# Altium project eBox.PrjPcb
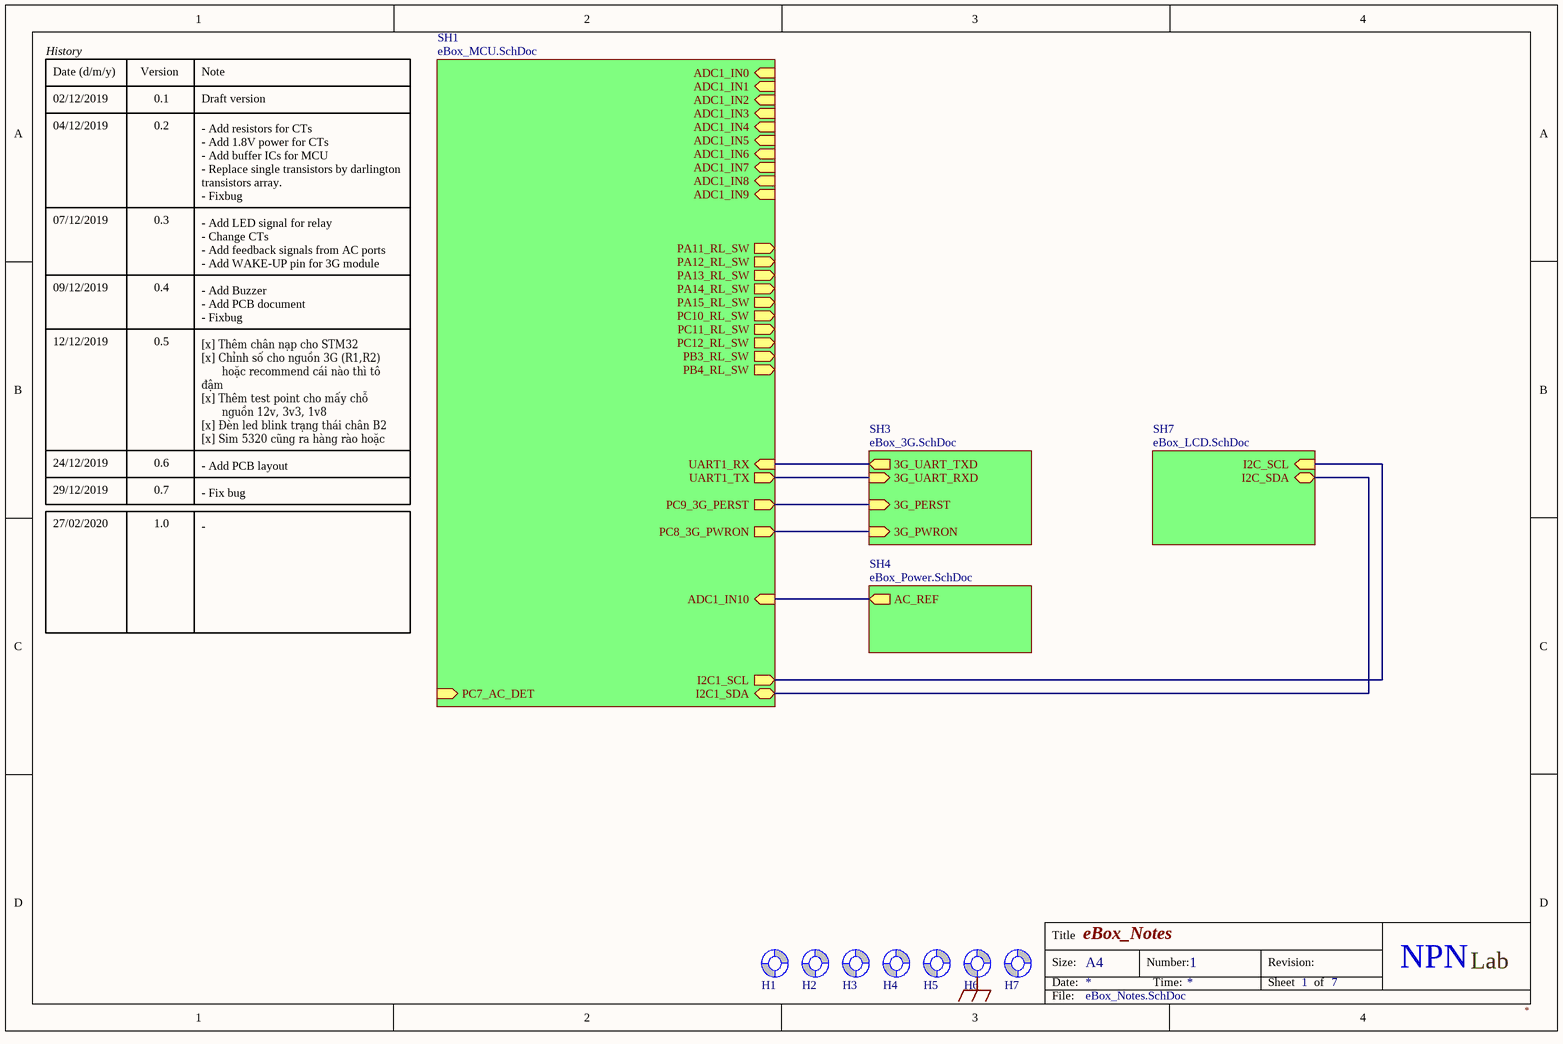
[diagram p0: eBox_Notes.SchDoc]
prjVersion: 2.0
6 sheets, 184 parts. Net scope: hierarchical (ports join the sheet entries above them; power ports are global).
Board file: eBox.PcbDoc
Sheets:
  eBox_Notes.SchDoc
    SH1 = eBox_MCU.SchDoc
    SH3 = eBox_3G.SchDoc
    SH4 = eBox_Power.SchDoc
    SH7 = eBox_LCD.SchDoc
  highcurrentsensing.SchDoc

## Sheet eBox_Notes.SchDoc: eBox_Notes
size A4; DocumentNumber: 1; Revision: 2.0; SheetNumber: 1; SheetTotal: 7

### Parts
H1  Screw Hole  [SCREW/3.2/7.0/M]  (value not drawn)  (no BOM)
H2  Screw Hole  [SCREW/3.2/7.0/M]  (value not drawn)  (no BOM)
H3  Screw Hole  [SCREW/3.2/7.0/M]  (value not drawn)  (no BOM)
H4  Screw Hole  [SCREW/3.2/7.0/M]  (value not drawn)  (no BOM)
H5  Screw Hole  [SCREW/3.2/7.0/M]  (value not drawn)  (no BOM)
H6  Screw Hole  [SCREW/3.2/7.0/M]  (value not drawn)  (no BOM)
H7  Screw Hole  [SCREW/3.2/7.0/M]  (value not drawn)  (no BOM)

### Sub-sheets
SH1 = eBox_MCU.SchDoc: PC8_3G_PWRON (out), PC9_3G_PERST (out), UART1_RX (in), UART1_TX (out), ADC1_IN0 (in), ADC1_IN1 (in), ADC1_IN2 (in), ADC1_IN3 (in), ADC1_IN4 (in), ADC1_IN5 (in), ADC1_IN6 (in), ADC1_IN9 (in), ADC1_IN7 (in), PA12_RL_SW (out), ADC1_IN8 (in), PA11_RL_SW (out), PA13_RL_SW (out), PA14_RL_SW (out), PA15_RL_SW (out), PC10_RL_SW (out), PC11_RL_SW (out), PB3_RL_SW (out), PB4_RL_SW (out), PC12_RL_SW (out), I2C1_SCL (out), I2C1_SDA (bidir), PC7_AC_DET (in), ADC1_IN10 (in)
SH3 = eBox_3G.SchDoc: 3G_UART_RXD (in), 3G_PERST (in), 3G_PWRON (in), 3G_UART_TXD (out)
SH4 = eBox_Power.SchDoc: AC_REF (out)
SH7 = eBox_LCD.SchDoc: I2C_SCL (in), I2C_SDA (bidir)

### Nets
GNDEARTH: H6.1(Screw)
I2C1_SCL: sheet SH1/I2C1_SCL, sheet SH7/I2C_SCL
I2C1_SDA: sheet SH1/I2C1_SDA, sheet SH7/I2C_SDA
PERST: sheet SH1/PC9_3G_PERST, sheet SH3/3G_PERST
PWRON: sheet SH1/PC8_3G_PWRON, sheet SH3/3G_PWRON
UART_RXD: sheet SH1/UART1_RX, sheet SH3/3G_UART_TXD
UART_TXD: sheet SH1/UART1_TX, sheet SH3/3G_UART_RXD
NetR103_1: sheet SH1/ADC1_IN10, sheet SH4/AC_REF

Not connected (* = marked no-connect by the designer): H1 1(Screw); H2 1(Screw); H3 1(Screw); H4 1(Screw); H5 1(Screw); H7 1(Screw)

### Notes on the sheet
- History
- Date (d/m/y)
- 02/12/2019
- Version
- 0.1
- Note
- Draft version
- 04/12/2019
- 0.2
- 07/12/2019
- 0.3
- - Add resistors for CTs
  - Add 1.8V power for CTs
  - Add buffer ICs for MCU
  - Replace single transistors by darlington  transistors array.
  - Fixbug
- 09/12/2019
- 0.4
- - Add LED signal for relay
  - Change CTs
  - Add feedback signals from AC ports
  - Add WAKE-UP pin for 3G module
- 12/12/2019
- 0.5
- - Add Buzzer
  - Add PCB document
  - Fixbug
- [x] Thêm chân nạp cho STM32
  [x] Chỉnh số cho nguồn 3G (R1,R2)
  hoặc recommend cái nào thì tô đậm
  [x] Thêm test point cho mấy chỗ
  nguồn 12v, 3v3, 1v8
  [x] Đèn led blink trạng thái chân B2
  [x] Sim 5320 cũng ra hàng rào hoặc
  test point uart để test
- 24/12/2019
- 29/12/2019
- 0.6
- 0.7
- - Add PCB layout
- - Fix bug
- 27/02/2020
- 1.0
- -
- Title
- Size:
- Date:
- A4
- Number:
- Time:
- Revision:
- Sheet
- of
- NPN
- Lab
- File:

### Library data of the parts
H1-H7 = Screw Hole: TYPE: NO-BOM; UNIT PRICE: 0

## Sheet eBox_MCU.SchDoc: eBox_MCU
size A4; DocumentNumber: 3; Revision: 2.0; SheetNumber: 3; SheetTotal: 7
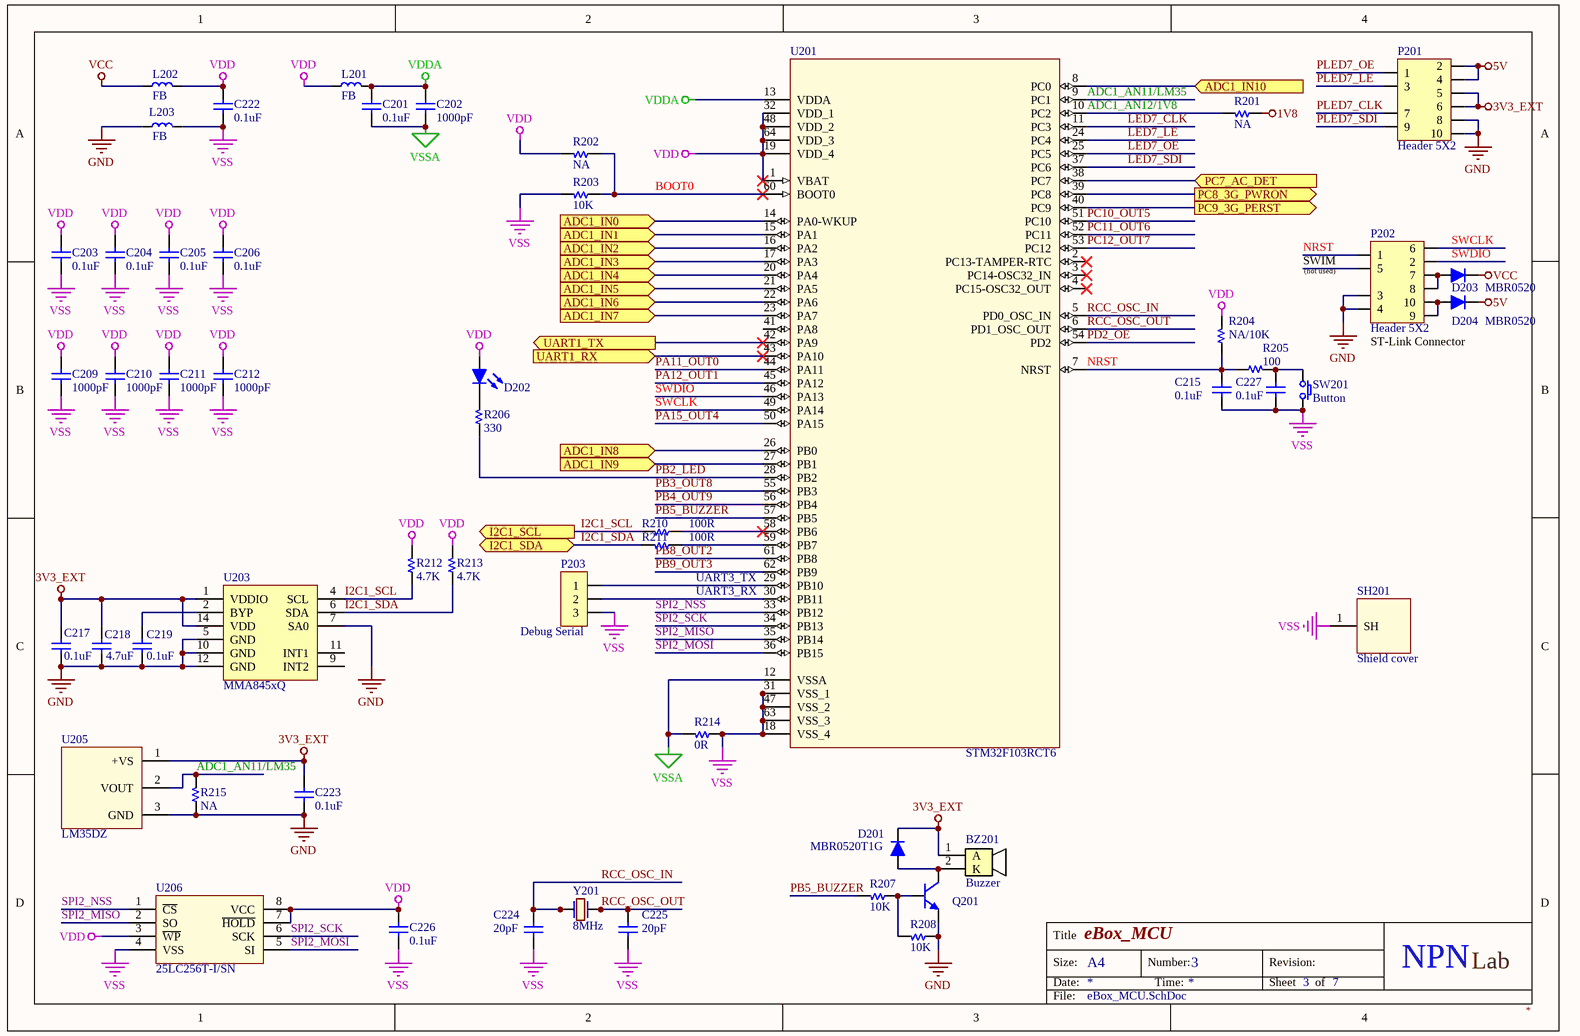
[diagram p1: eBox_MCU.SchDoc]

### Parts
BZ201  Buzzer  [BUZZER]
C201  0.1uF  [C 0603]
C202  1000pF  [C 0603]
C203  0.1uF  [C 0603]
C204  0.1uF  [C 0603]
C205  0.1uF  [C 0603]
C206  0.1uF  [C 0603]
C209  1000pF  [C 0603]
C210  1000pF  [C 0603]
C211  1000pF  [C 0603]
C212  1000pF  [C 0603]
C215  0.1uF  [C 0603]
C217  0.1uF  [C 0603]
C218  4.7uF  [C 0603]
C219  0.1uF  [C 0603]
C222  0.1uF  [C 0805]
C223  0.1uF  [C 0603]
C224  20pF  [C 0603]
C225  20pF  [C 0603]
C226  0.1uF  [C 0603]
C227  0.1uF  [C 0603]
D201  MBR0520T1G  [Diode SOD-123]
D202  5V Led  [LED 3MM - blue]  (value not drawn)
D203  MBR0520  [SOD123]
D204  MBR0520  [SOD123]
L201  FB  [L 0805 (2012)]
L202  FB  [L 0805 (2012)]
L203  FB  [L 0805 (2012)]
P201  Header 5X2  [HDR/Header/10/DL/BOX]
P202  Header 5X2  [HDR/Header/10/DL/BOX]
P203  Debug Serial  [HDR/Header/3]
Q201  LMBT3904LT1G  [SOT-23]  (value not drawn)
R201  NA  [R 0603]
R202  NA  [R 0603]
R203  10K  [R 0603]
R204  NA/10K  [R 0603]
R205  100  [R 0603]
R206  330  [R 0603]
R207  10K  [R 0603]
R208  10K  [R 0603]
R210  100R  [R 0603]
R211  100R  [R 0603]
R212  4.7K  [R 0603]
R213  4.7K  [R 0603]
R214  0R  [R 0603]
R215  NA  [R 0603]
SH201  Shield cover  [SHIELD COVER 50x35]  (no BOM)
SW201  Button  [SW/2/DIP]
U201  STM32F103RCT6  [STM-LQFP64]
U203  MMA845xQ  [MMA845xQ]
U205  LM35DZ  [TO-92/W100]
U206  25LC256T-I/SN  [SOIC-8-I/SN]
Y201  8MHz  [Crystal HC49US SMD]
Y202  NA  [Crystal HC49S DIP]  (value not drawn)  (no BOM)

### Ports
ADC1_IN0 (in), ADC1_IN1 (in), ADC1_IN2 (in), ADC1_IN3 (in), ADC1_IN4 (in), ADC1_IN5 (in), ADC1_IN6 (in), ADC1_IN7 (in), ADC1_IN8 (in), ADC1_IN9 (in), ADC1_IN10 (in), I2C1_SCL (out), I2C1_SDA (bidir), PC7_AC_DET (in), PC8_3G_PWRON (out), PC9_3G_PERST (out), UART1_RX (in), UART1_TX (out)

### Nets
1V8: R201.1
3V3_EXT: BZ201.1(A) C217.1 C218.1 C223.1 D201.2(K) P201.5 P201.6 U203.1(VDDIO) U203.14(VDD) U205.1(+VS)
5V: D204.2(K) P201.2 P201.4
GND: C217.2 C218.2 C219.2 C223.2 L203.1 P201.8 P201.10 P202.3 P202.4 Q201.2(E) R208.1 R215.1 U203.5(GND) U203.7(SA0) U203.10(GND) U203.12(GND) U205.3(GND)
VCC: D203.2(K) L202.1
VDD: C203.1 C204.1 C205.1 C206.1 C209.1 C210.1 C211.1 C212.1 C222.1 C226.1 D202.1(A) L201.1 L202.2 R202.2 R204.2 R212.2 R213.2 U201.1(VBAT) U201.19(VDD_4) U201.32(VDD_1) U201.48(VDD_2) U201.64(VDD_3) U206.3(~{WP}) U206.7(~{HOLD}) U206.8(VCC)
VDDA: C201.1 C202.1 L201.2 U201.13(VDDA)
VSS: C203.2 C204.2 C205.2 C206.2 C209.2 C210.2 C211.2 C212.2 C215.2 C222.2 C224.2 C225.2 C226.2 C227.2 L203.2 P203.3 R203.2 R214.1 SH201.1(SH) SW201.2 U201.18(VSS_4) U201.31(VSS_1) U201.47(VSS_2) U201.63(VSS_3) U206.4(VSS)
VSSA: C201.2 C202.2 R214.2 U201.12(VSSA)
ADC1_AN11/LM35: R215.2 U201.9(PC1) U205.2(VOUT)
ADC1_AN12/1V8: R201.2 U201.10(PC2)
BOOT0: R202.1 R203.1 U201.60(BOOT0)
I2C1_SCL: R210.2 R212.1 U203.4(SCL) ; port I2C1_SCL
I2C1_SDA: R211.2 R213.1 U203.6(SDA) ; port I2C1_SDA
LED7_CLK: U201.11(PC3)
LED7_LE: U201.24(PC4)
LED7_OE: U201.25(PC5)
LED7_SDI: U201.37(PC6)
NRST: C215.1 P202.1 R204.1 R205.1 U201.7(NRST)
PA11_OUT0: U201.44(PA11)
PA12_OUT1: U201.45(PA12)
PA15_OUT4: U201.50(PA15)
PB2_LED: R206.1 U201.28(PB2)
PB3_OUT8: U201.55(PB3)
PB4_OUT9: U201.56(PB4)
PB5_BUZZER: R207.2 U201.57(PB5)
PB8_OUT2: U201.61(PB8)
PB9_OUT3: U201.62(PB9)
PC10_OUT5: U201.51(PC10)
PC11_OUT6: U201.52(PC11)
PC12_OUT7: U201.53(PC12)
PD2_OE: U201.54(PD2)
PERST: U201.40(PC9) ; port PC9_3G_PERST
PLED7_CLK: P201.7
PLED7_LE: P201.3
PLED7_OE: P201.1
PLED7_SDI: P201.9
PWRON: U201.39(PC8) ; port PC8_3G_PWRON
RCC_OSC_IN: C224.1 U201.5(PD0_OSC_IN) Y201.1 Y202.1
RCC_OSC_OUT: C225.1 U201.6(PD1_OSC_OUT) Y201.2 Y202.2
SPI2_MISO: U201.35(PB14) U206.2(SO)
SPI2_MOSI: U201.36(PB15) U206.5(SI)
SPI2_NSS: U201.33(PB12) U206.1(~{CS})
SPI2_SCK: U201.34(PB13) U206.6(SCK)
SWCLK: P202.6 U201.49(PA14)
SWDIO: P202.2 U201.46(PA13)
UART3_RX: P203.2 U201.30(PB11)
UART3_TX: P203.1 U201.29(PB10)
UART_RXD: U201.43(PA10) ; port UART1_RX
UART_TXD: U201.42(PA9) ; port UART1_TX
NetBZ201_2: BZ201.2(K) D201.1(A) Q201.3(C)
NetC219_1: C219.1 U203.2(BYP)
NetC227_1: C227.1 R205.2 SW201.1
NetD202_2: D202.2(K) R206.2
NetD203_1: D203.1(A) P202.7 P202.8
NetD204_1: D204.1(A) P202.9 P202.10
NetQ201_1: Q201.1(B) R207.1 R208.2
NetR103_1: U201.8(PC0) ; port ADC1_IN10
NetR210_1: R210.1 U201.58(PB6)
NetR211_1: R211.1 U201.59(PB7)
NetU201_14: U201.14(PA0-WKUP) ; port ADC1_IN0
NetU201_15: U201.15(PA1) ; port ADC1_IN1
NetU201_16: U201.16(PA2) ; port ADC1_IN2
NetU201_17: U201.17(PA3) ; port ADC1_IN3
NetU201_20: U201.20(PA4) ; port ADC1_IN4
NetU201_21: U201.21(PA5) ; port ADC1_IN5
NetU201_22: U201.22(PA6) ; port ADC1_IN6
NetU201_23: U201.23(PA7) ; port ADC1_IN7
NetU201_26: U201.26(PB0) ; port ADC1_IN8
NetU201_27: U201.27(PB1) ; port ADC1_IN9
NetU201_38: U201.38(PC7) ; port PC7_AC_DET

Not connected (* = marked no-connect by the designer): P202 5; U201 2(PC13-TAMPER-RTC)* 3(PC14-OSC32_IN)* 4(PC15-OSC32_OUT)* 41(PA8); U203 9(INT2) 11(INT1)

### Notes on the sheet
- (near P202) SWIM
- (near P202) (not used)
- ST-Link Connector
- Title
- Size:
- Date:
- A4
- Number:
- Time:
- Revision:
- Sheet
- of
- NPN
- Lab
- File:

### Library data of the parts
C201-C206 C209-C212 C215 C217 C219 C222 C223 C226 C227 = Capacitor NP: CAP CER 0.1UF 50V X7R 0603; TYPE: SMD; PACKAGE: SMD0603; STOCK CODE: CC0603KRX7R9BB104; SUPPLIER: tme.vn; STOCK DESC: 100nF/50V ±10% X7R SMD-0603 Capacitor; UNIT PRICE: 400
C218 = Capacitor NP: CAP CER 4.7UF 50V X7R 0603; TYPE: SMD; PACKAGE: SMD0603; STOCK CODE: CC0603KRX5R6BB475; SUPPLIER: tme.vn; STOCK DESC: 4.7uF 10V ±10% X5R SMD-0603 Capacitor; UNIT PRICE: 600
C224 C225 = Capacitor NP: CAP CER 9pF 50V X7R 0603; TYPE: SMD; PACKAGE: SMD0603; STOCK CODE: CC0603JRNPO9BN100; SUPPLIER: tme.vn; STOCK DESC: 10pF/50V ±5% NPO SMD-0603 Capacitor; UNIT PRICE: 400
D201 = Diode: 0.5A 20V SMD Schottky Rectifier Diode; PACKAGE: SOD123; PART NO: MBR0520T1G; STOCK CODE: MBR0520T1G; SUPPLIER: tme.vn; TYPE: SMD; STOCK DESC: 0.5A 20V SMD Schottky Rectifier Diode; UNIT PRICE: 2000
D202 = Led: LED RED CLEAR 0603 SMD; TYPE: TH; PACKAGE: 3MM; STOCK CODE: HT204SURD; SUPPLIER: tme.vn; STOCK DESC: 3mm Base LED; UNIT PRICE: 300
D203 D204 = Diode: Default Diode
L201-L203 = Inductor
P201 P202 = Header 5X2: Header, 5-Pin, Dual row; UNIT PRICE: 0
P203 = Header 3: Header, 3-Pin; UNIT PRICE: 0
Q201 = Transistor NPN: TRANS NPN 40V 0.2A SMD SOT23-3; STOCK CODE: LMBT3904LT1G; SUPPLIER: tme.vn; TYPE: SMD; STOCK DESC: NPN General-Purpose Amplifier SMD Transistor; UNIT PRICE: 600
R201-R205 R207 R208 = Resistor: RES SMD 10K OHM 1% 1/10W 0603; PACKAGE: SMD0603
  R201 R204: TYPE: N/A; UNIT PRICE: 0
  R202 R203 R205 R207 R208: STOCK CODE: RM06JTN103; SUPPLIER: tme.vn; TYPE: SMD; STOCK DESC: 10K ±5% SMD-0603 Resistor; UNIT PRICE: 50
R206 = Resistor: RES SMD 330 OHM 1% 1/10W 0603; PACKAGE: SMD0603; STOCK CODE: RM06JTN331; SUPPLIER: tme.vn; TYPE: SMD; STOCK DESC: 330R ±5% SMD-0603 Resistor; UNIT PRICE: 50
R210-R214 = Resistor: RES SMD 4.7K OHM 1% 1/10W 0603; PACKAGE: SMD0603; STOCK CODE: RM06JTN472; SUPPLIER: tme.vn; TYPE: SMD; STOCK DESC: 4.7K ±5% SMD-0603 Resistor; UNIT PRICE: 50
R215 = Resistor: RES SMD ? OHM 1% 1/10W 0603; PACKAGE: SMD0603; TYPE: N/A; UNIT PRICE: 0
SW201 = SW SPST: Tact switch 2 pin; STOCK CODE: KAN0611-0501B; SUPPLIER: tme.vn; TYPE: TH; STOCK DESC: Tact Switch 6x6x5 mm Black; UNIT PRICE: 1000
U201 = STM32F103RBT6: Mainstream Performance line, ARM Cortex-M3 MCU with 128 Kbytes Flash, 72 MHz CPU, motor control, USB and CAN; Package: LQFP-64; PART NO: STM32F103RCT6; STOCK CODE: STM32F103RCT6; SUPPLIER: tme.vn; TYPE: SMD; STOCK DESC: MCU ARM 256KB FLASH LQFP-64; UNIT PRICE: 70000
U203 = MMA845xQ: Freescale's 3-axis digital accelerometer; PART NO: MMA8452Q; BRAND: Freescale; PACKAGE: QFN-16; STOCK CODE: MMA8452Q; SUPPLIER: tme.vn; TYPE: SMD; STOCK DESC: 3-Axis, 12-bit/8-bit Digital Accelerometer; UNIT PRICE: 60000
U205 = LM35DZ: SENSOR ANALOG 0C-100C TO92-3; PACKAGE: TO-92; STOCK CODE: LM35DZ; SUPPLIER: tme.vn; TYPE: TH; STOCK DESC: Analog Thermometer; UNIT PRICE: 30000
U206 = 25LC256T-I/SN: IC EEPROM 256K SPI 10MHZ 8SOIC; PART NO: 25LC256-I/SN; BRAND: Microchip; PACKAGE: SOIC-8; STOCK CODE: 25LC256-I/SN; SUPPLIER: tme.vn; TYPE: SMD; STOCK DESC: 256 Kbit SPI Bus Serial EEPROM, 10MHZ 8SOIC; UNIT PRICE: 25000
Y201 Y202 = Crystal
BZ201 = Buzzer: STOCK CODE: YMD-12065G-5V; SUPPLIER: tme.vn; TYPE: TH; STOCK DESC: 5V Magneticc Buzzer, 85dB, 6.5x12 mm; UNIT PRICE: 5000

## Sheet eBox_3G.SchDoc: eBox_3G
size A4; DocumentNumber: 4; Revision: 2.0; SheetNumber: 4; SheetTotal: 7
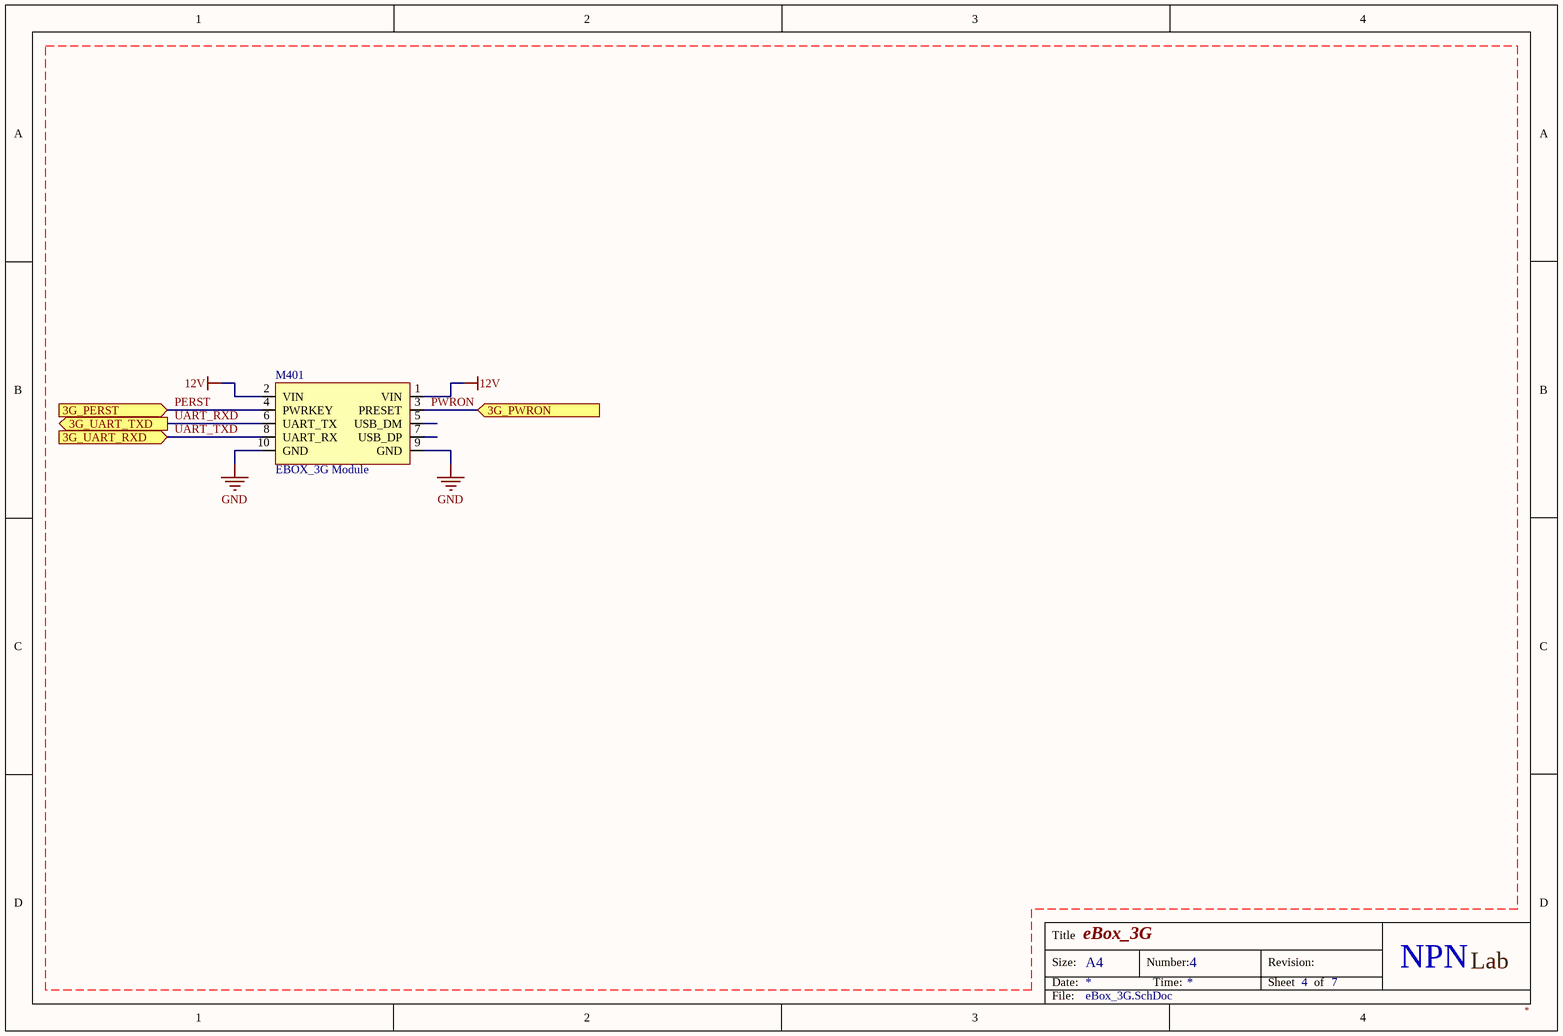
[diagram p2: eBox_3G.SchDoc]

### Parts
M401  EBOX_3G Module  [EBOX_3G]

### Ports
3G_PERST (in), 3G_PWRON (in), 3G_UART_RXD (in), 3G_UART_TXD (out)

### Nets
12V: M401.1(VIN) M401.2(VIN)
GND: M401.9(GND) M401.10(GND)
PERST: M401.4(PWRKEY) ; port 3G_PERST
PWRON: M401.3(PRESET) ; port 3G_PWRON
UART_RXD: M401.6(UART_TX) ; port 3G_UART_TXD
UART_TXD: M401.8(UART_RX) ; port 3G_UART_RXD

Not connected (* = marked no-connect by the designer): M401 5(USB_DM) 7(USB_DP)

### Notes on the sheet
- Title
- Size:
- Date:
- A4
- Number:
- Time:
- Revision:
- Sheet
- of
- NPN
- Lab
- File:

## Sheet eBox_Power.SchDoc: eBox_Power
size A4; DocumentNumber: 2; Revision: 2.0; SheetNumber: 2; SheetTotal: 6
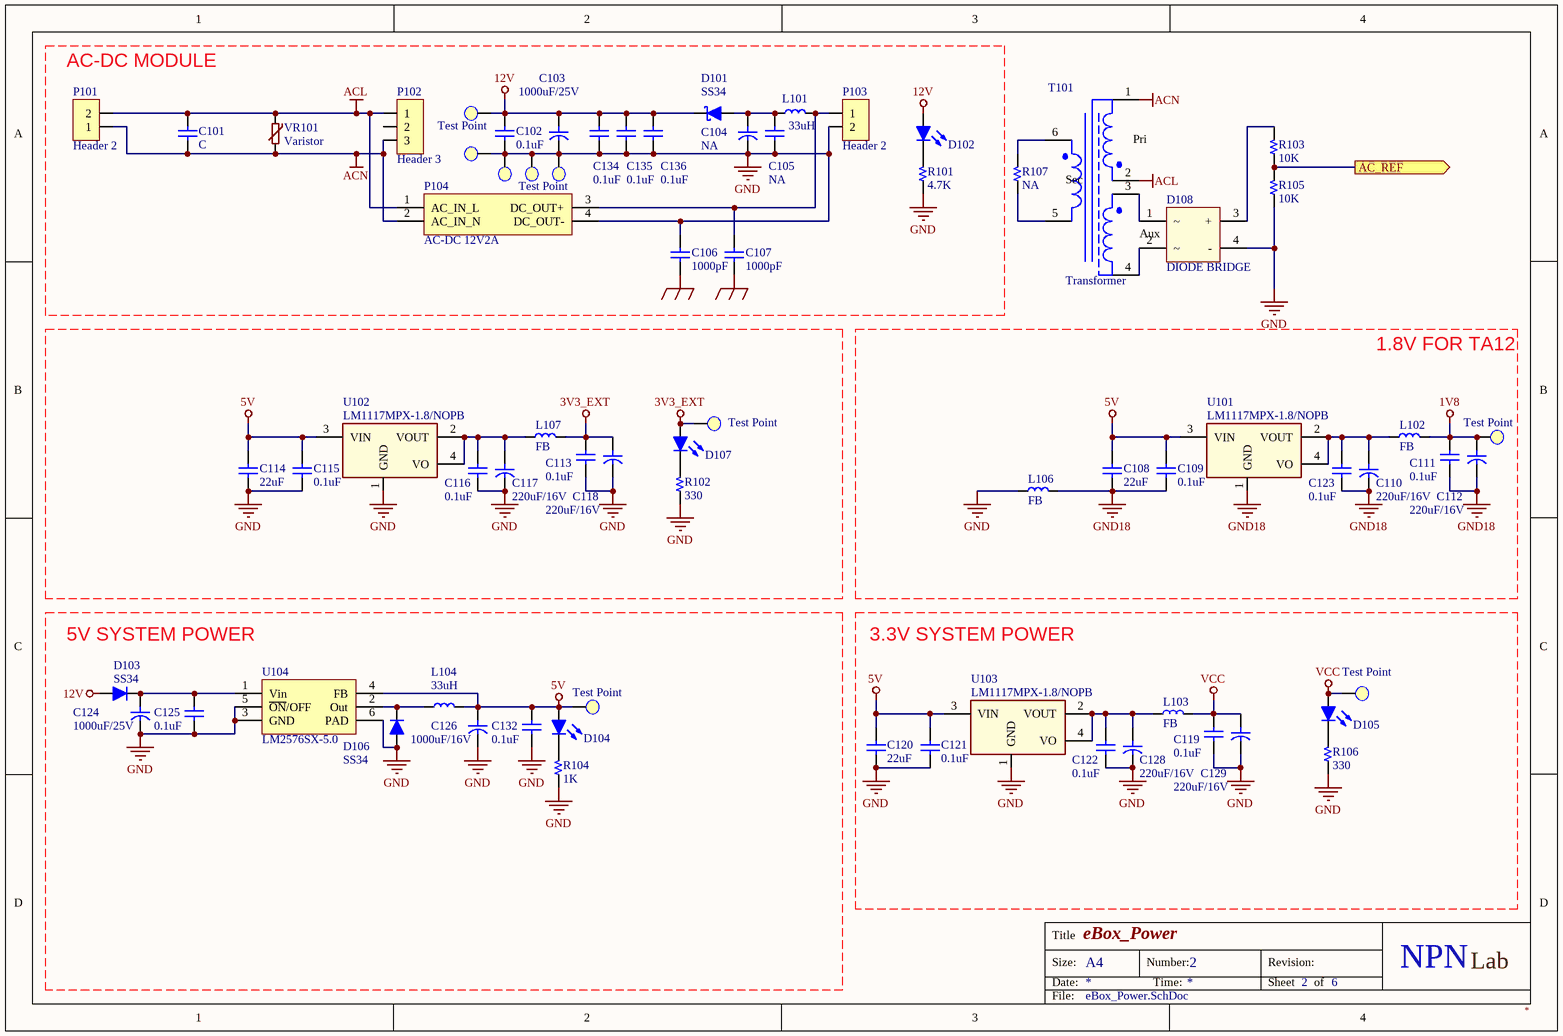
[diagram p3: eBox_Power.SchDoc]

### Parts
1V8  Test Point  [TestPoint/SMD/1.5mm]  (no BOM)
3V3  Test Point  [TestPoint/SMD/1.5mm]  (no BOM)
5V  Test Point  [TestPoint/SMD/1.5mm]  (no BOM)
12V  Test Point  [TestPoint/SMD/1.5mm]  (no BOM)
C101  C  [CAP Ceramic/D7.0/F7.5]
C102  0.1uF  [C 0805]
C103  1000uF/25V  [CAP/D100/H200/LS50]
C104  NA  [CAP/D100/H200/LS50]
C105  NA  [C 0805]
C106  1000pF  [CAP Ceramic/W300]
C107  1000pF  [CAP Ceramic/W300]
C108  22uF  [C 1210]
C109  0.1uF  [C 0805]
C110  220uF/16V  [CYL/D.250/LS.100]
C111  0.1uF  [C 0805]
C112  220uF/16V  [CYL/D.250/LS.100]
C113  0.1uF  [C 0805]
C114  22uF  [C 1210]
C115  0.1uF  [C 0805]
C116  0.1uF  [C 0805]
C117  220uF/16V  [CYL/D.250/LS.100]
C118  220uF/16V  [CYL/D.250/LS.100]
C119  0.1uF  [C 0805]
C120  22uF  [C 1210]
C121  0.1uF  [C 0805]
C122  0.1uF  [C 0805]
C123  0.1uF  [C 0805]
C124  1000uF/25V  [CAP/D100/H200/LS50]
C125  0.1uF  [C 0805]
C126  1000uF/16V  [CAP/D100/H200/LS50]
C128  220uF/16V  [CYL/D.250/LS.100]
C129  220uF/16V  [CYL/D.250/LS.100]
C132  0.1uF  [C 0805]
C134  0.1uF  [C 0805]
C135  0.1uF  [C 0805]
C136  0.1uF  [C 0805]
D101  SS34  [DO-214AB (SMC)]
D102  5V Led  [LED 3MM - red]  (value not drawn)
D103  SS34  [DO-214AC (SMA) L]
D104  5V Led  [LED 3MM - red]  (value not drawn)
D105  5V Led  [LED 3MM - red]  (value not drawn)
D106  SS34  [DO-214AC (SMA) L]
D107  5V Led  [LED 3MM - red]  (value not drawn)
D108  DIODE BRIDGE  [DiodeBridge-SOIC4]
GND1  Test Point  [TESTPOINT/1/Black]  (no BOM)
GND2  Test Point  [TESTPOINT/1/Black]  (value not drawn)  (no BOM)
GND3  Test Point  [TESTPOINT/1/Black]  (value not drawn)  (no BOM)
GND4  Test Point  [TESTPOINT/1/Black]  (value not drawn)  (no BOM)
L101  33uH  [Inductor SMD 6.5x6.5x3.0]
L102  FB  [L 0805 (2012)]  (no BOM)
L103  FB  [L 0805 (2012)]  (no BOM)
L104  33uH  [Inductor SMD 12x12x8]
L105  33uH  [Inductor SMD 12x12x8]  (value not drawn)  (no BOM)
L106  FB  [L 0805 (2012)]
L107  FB  [L 0805 (2012)]  (no BOM)
P101  Header 2  [HDR/Terminal/2/10mm]
P102  Header 3  [HDR/Header/3/VH]
P103  Header 2  [HDR/Header/2/VH]
P104  AC-DC 12V2A  [AC-DC 12V2A]
R101  4.7K  [R 0603]
R102  330  [R 0603]
R103  10K  [R 0805]
R104  1K  [R 0603]
R105  10K  [R 0805]
R106  330  [R 0603]
R107  NA  [R 0805]
T101  Transformer  [Trans. EE10/6P/F]
U101  LM1117MPX-1.8/NOPB  [SOT-223]
U102  LM1117MPX-1.8/NOPB  [SOT-223]
U103  LM1117MPX-1.8/NOPB  [SOT-223]
U104  LM2576SX-5.0  [TO-263-6]
VCC  Test Point  [TestPoint/SMD/1.5mm]  (no BOM)
VR101  Varistor  [VARISTOR DISC 5MM/7MM]

### Ports
AC_REF (out)

### Nets
1V8: 1V8.1(TP) C111.1 C112.1 L102.2
3V3_EXT: 3V3.1(TP) C113.1 C118.1 D107.1(A) L107.2
5V: 5V.1(TP) C108.1 C109.1 C114.1 C115.1 C120.1 C121.1 C126.1 C132.1 D104.1(A) L104.2 U101.3(VIN) U102.3(VIN) U103.3(VIN) U104.4(FB)
12V: 12V.1(TP) C102.1 C103.1 C134.1 C135.1 C136.1 D101.2(K) D102.1(A) D103.1(A)
ACL: C101.1 P101.2 P102.1 P104.1(AC_IN_L) T101.2(A2) VR101.2
ACN: C101.2 P101.1 P102.3 P104.2(AC_IN_N) T101.1(A1) VR101.1
GND: C102.2 C103.2 C104.2 C105.2 C106.1 C113.2 C114.2 C115.2 C116.2 C117.2 C118.2 C119.2 C120.2 C121.2 C122.2 C124.2 C125.2 C126.2 C128.2 C129.2 C132.2 C134.2 C135.2 C136.2 D106.1(A) D108.4(-) GND1.1(TP) GND2.1(TP) GND3.1(TP) GND4.1(TP) L106.1 P103.2 P104.4(DC_OUT-) R101.1 R102.1 R104.1 R105.1 R106.1 U102.1(GND) U103.1(GND) U104.3(GND) U104.5(~{ON}/OFF) U104.6(PAD)
GND18: C108.2 C109.2 C110.2 C111.2 C112.2 C123.2 L106.2 U101.1(GND)
GNDEARTH: C106.2 C107.2
VCC: C119.1 C129.1 D105.1(A) L103.2 VCC.1(TP)
NetC104_1: C104.1 C105.1 D101.1(A) L101.1 L105.1
NetC107_1: C107.1 L101.2 L105.2 P103.1 P104.3(DC_OUT+)
NetC110_1: C110.1 C123.1 L102.1 U101.2(VOUT) U101.4(VO)
NetC116_1: C116.1 C117.1 L107.1 U102.2(VOUT) U102.4(VO)
NetC122_1: C122.1 C128.1 L103.1 U103.2(VOUT) U103.4(VO)
NetC124_1: C124.1 C125.1 D103.2(K) U104.1(Vin)
NetD102_2: D102.2(K) R101.2
NetD104_2: D104.2(K) R104.2
NetD105_2: D105.2(K) R106.2
NetD106_2: D106.2(K) L104.1 U104.2(Out)
NetD107_2: D107.2(K) R102.2
NetD108_1: D108.1 T101.3(B1)
NetD108_2: D108.2 T101.4(B2)
NetD108_3: D108.3(+) R103.2
NetR103_1: R103.1 R105.2 ; port AC_REF
NetR107_1: R107.1 T101.5(C2)
NetR107_2: R107.2 T101.6(C1)

Not connected (* = marked no-connect by the designer): P102 2

### Notes on the sheet
- AC-DC MODULE
- 1.8V FOR TA12
- 5V SYSTEM POWER
- 3.3V SYSTEM POWER
- Title
- Size:
- Date:
- A4
- Number:
- Time:
- Revision:
- Sheet
- of
- NPN
- Lab
- File:
- (in symbol Trans 6-PIN) Pri; Sec; Aux

### Library data of the parts
C101 C106 C107 = Capacitor NP: Capacitor non-pol
C102 C109 C111 C113 C115 C116 C119 C121-C123 = Capacitor NP: CAP CER 0.1UF 50V X7R 0603; TYPE: SMD; PACKAGE: SMD0603; STOCK CODE: CC0603KRX7R9BB104; SUPPLIER: tme.vn; STOCK DESC: 100nF/50V ±10% X7R SMD-0603 Capacitor; UNIT PRICE: 400
C103 C104 C124 C126 = Capacitor: Capacitor pol; BRAND: JWCO; TYPE: TH; PACKAGE: 10x17mm; STOCK CODE: 1000uF/25V; SUPPLIER: tme.vn; STOCK DESC: 1000uF/25V ±20% Aluminum Electrolytic Capacitor, Size 10x17mm; UNIT PRICE: 3000
C105 C125 C132 C134-C136 = Capacitor NP: CAP CER 0.1UF 50V X7R 0805; TYPE: SMD; PACKAGE: SMD0603; STOCK CODE: CC0603KRX7R9BB104; SUPPLIER: tme.vn; STOCK DESC: 100nF/50V ±10% X7R SMD-0603 Capacitor; UNIT PRICE: 400
C108 C114 C120 = Capacitor NP: CAP CER 22UF 50V X7R 1210; TYPE: SMD; PACKAGE: SMD1210; STOCK CODE: CC1210KKX7R7BB226; SUPPLIER: tme.vn; STOCK DESC: 22uF/16V ±10% X7R SMD-1210 Capacitor; UNIT PRICE: 2500
C110 C112 C117 C118 C128 C129 = Capacitor: CAP TANT 100UF 20% 16V 2917; TYPE: SMD; PACKAGE: SMD7343; STOCK CODE: TAJD107M016RNJ; SUPPLIER: tme.vn; STOCK DESC: 100uF/16V ±20% SMD Tantalum Capacitor; UNIT PRICE: 9000
D101 = Diode Schottky: DIODE SCHOTTKY 40V 3A SUB SMA; BRAND: Toshiba; TYPE: SMD; PACKAGE: DO-214AC; PART NO: SS34; STOCK CODE: SS34; SUPPLIER: tme.vn; STOCK DESC: 3A 40V Schottky Barrier Diode; UNIT PRICE: 2000
D102 D104 D105 D107 = Led: LED RED CLEAR 0603 SMD; TYPE: TH; PACKAGE: 3MM; STOCK CODE: HT204SURD; SUPPLIER: tme.vn; STOCK DESC: 3mm Base LED; UNIT PRICE: 300
D103 D106 = Diode: Default Diode
D108 = DIODE BRIDGE: pin to pad: 1>3 2>4 3>1 4>2
L101 = Inductor: FIXED IND 2.2UH 3A 105 MOHM SMD; PART NO: MHCI06030-2R2M-R8; PACKAGE: SMD06030; SUPPLIER: CHINA; TYPE: SMD; UNIT PRICE: 2500
L102 L103 L107 = Inductor: TYPE: NO-BOM; UNIT PRICE: 0
L104-L106 = Inductor
P101 P103 = Header 2: Header, 2-Pin; UNIT PRICE: 0
P102 = Header 3: Header, 3-Pin; UNIT PRICE: 0
P104 = AC-DC 12V3A: SUPPLIER: CHINA; TYPE: TH; UNIT PRICE: 558676
R101 R103 R105 R107 = Resistor: RES SMD 4.7K OHM 1% 1/10W 0603; PACKAGE: SMD0603; STOCK CODE: RM06JTN472; SUPPLIER: tme.vn; TYPE: SMD; STOCK DESC: 4.7K ±5% SMD-0603 Resistor; UNIT PRICE: 50
R102 R106 = Resistor: RES SMD 330 OHM 1% 1/10W 0603; PACKAGE: SMD0603; STOCK CODE: RM06JTN331; SUPPLIER: tme.vn; TYPE: SMD; STOCK DESC: 330R ±5% SMD-0603 Resistor; UNIT PRICE: 50
R104 = Resistor: RES SMD 1K OHM 1% 1/10W 0603; PACKAGE: SMD0603; STOCK CODE: RM06JTN102; SUPPLIER: tme.vn; TYPE: SMD; STOCK DESC: 1K ±5% SMD-0603 Resistor; UNIT PRICE: 50
T101 = Trans 6-PIN: Transformer 6-PIN
U101-U103 = AMS1117: IC REG LINEAR 1.8V 800MA SOT223; BRAND: AMS; PACKAGE: SOT-223; STOCK CODE: AMS1117-1.8; SUPPLIER: tme.vn; TYPE: SMD; STOCK DESC: 1.8V 1A Low-dropout Linear Regulator; UNIT PRICE: 4000
U104 = LM2576SX-5.0: IC REG BUCK 5V 3A TO263-5; PART NO: LM2576SX-5.0/NOPB; BRAND: TI; PACKAGE: TO-263-6; STOCK CODE: LM2576SX-5.0/NOPBCT-ND; SUPPLIER: Digi-Key; TYPE: SMD
1V8 3V3 5V 12V GND1-GND4 VCC = Test Point: TYPE: NO-BOM; UNIT PRICE: 0
VR101 = Varistor: UNIT PRICE: 0

## Sheet eBox_LCD.SchDoc: eBox_LCD
size A4; DocumentNumber: 4; Revision: 2.0; SheetNumber: 4; SheetTotal: 7
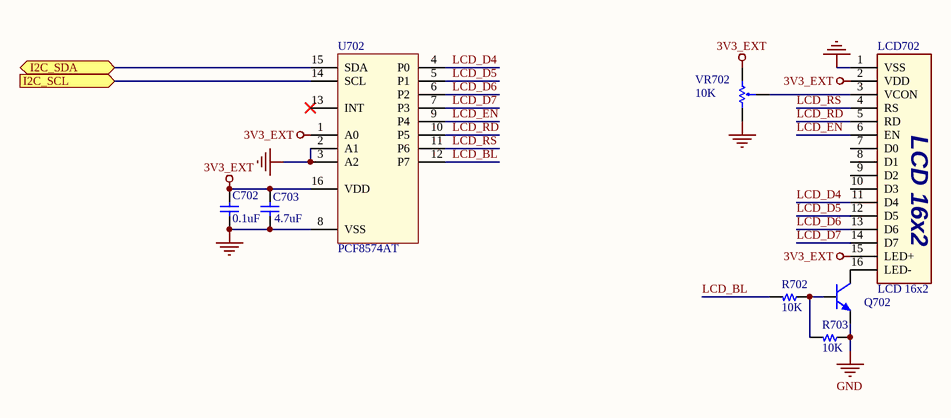
[diagram p4: eBox_LCD.SchDoc]

### Parts
C702  0.1uF  [C 0603]
C703  4.7uF  [C 0603]
LCD702  LCD 16x2  [LCD 1602A]
Q702  LMBT3904LT1G  [SOT-23]  (value not drawn)
R702  10K  [R 0603]
R703  10K  [R 0603]
U702  PCF8574AT  [SO16/PCF8574AT]
VR702  10K  [R VAR A 3D]

### Ports
I2C_SCL (in), I2C_SDA (bidir)

### Nets
3V3_EXT: C702.1 C703.1 LCD702.2(VDD) LCD702.15(LED+) U702.1(A0) U702.16(VDD) VR702.1
GND: C702.2 C703.2 LCD702.1(VSS) Q702.2(E) R703.1 U702.2(A1) U702.3(A2) U702.8(VSS) VR702.3
I2C1_SCL: U702.14(SCL) ; port I2C_SCL
I2C1_SDA: U702.15(SDA) ; port I2C_SDA
LCD_BL: R702.2 U702.12(P7)
LCD_D4: LCD702.11(D4) U702.4(P0)
LCD_D5: LCD702.12(D5) U702.5(P1)
LCD_D6: LCD702.13(D6) U702.6(P2)
LCD_D7: LCD702.14(D7) U702.7(P3)
LCD_EN: LCD702.6(EN) U702.9(P4)
LCD_RD: LCD702.5(RD) U702.10(P5)
LCD_RS: LCD702.4(RS) U702.11(P6)
NetLCD702_3: LCD702.3(VCON) VR702.2
NetLCD702_16: LCD702.16(LED-) Q702.3(C)
NetQ702_1: Q702.1(B) R702.1 R703.2

Not connected (* = marked no-connect by the designer): LCD702 7(D0) 8(D1) 9(D2) 10(D3); U702 13(INT)*

### Notes on the sheet
- Title
- Size:
- Date:
- A4
- Number:
- Time:
- Revision:
- Sheet
- of
- NPN
- Lab
- File:

### Library data of the parts
C702 = Capacitor NP: CAP CER 0.1UF 50V X7R 0603; TYPE: SMD; PACKAGE: SMD0603; STOCK CODE: CC0603KRX7R9BB104; SUPPLIER: tme.vn; STOCK DESC: 100nF/50V ±10% X7R SMD-0603 Capacitor; UNIT PRICE: 400
C703 = Capacitor NP: CAP CER 4.7UF 50V X7R 0603; TYPE: SMD; PACKAGE: SMD0603; STOCK CODE: CC0603KRX5R6BB475; SUPPLIER: tme.vn; STOCK DESC: 4.7uF 10V ±10% X5R SMD-0603 Capacitor; UNIT PRICE: 600
LCD702 = LCD 16x2: Character LCD 16x2
Q702 = Transistor NPN: TRANS NPN 40V 0.2A SMD SOT23-3; STOCK CODE: LMBT3904LT1G; SUPPLIER: tme.vn; TYPE: SMD; STOCK DESC: NPN General-Purpose Amplifier SMD Transistor; UNIT PRICE: 600
R702 R703 = Resistor: RES SMD 10K OHM 1% 1/10W 0603; PACKAGE: SMD0603; STOCK CODE: RM06JTN103; SUPPLIER: tme.vn; TYPE: SMD; STOCK DESC: 10K ±5% SMD-0603 Resistor; UNIT PRICE: 50
U702 = PCF8574AT: Remote 8-bit I/O expander for I2C-bus with interrupt; PART NO: PCF8574AT/3; BRAND: NXP; PACKAGE: SO16; SUPPLIER: CHINA; TYPE: SMD; UNIT PRICE: 6160
VR702 = Resistor Variable

## Sheet highcurrentsensing.SchDoc
size A
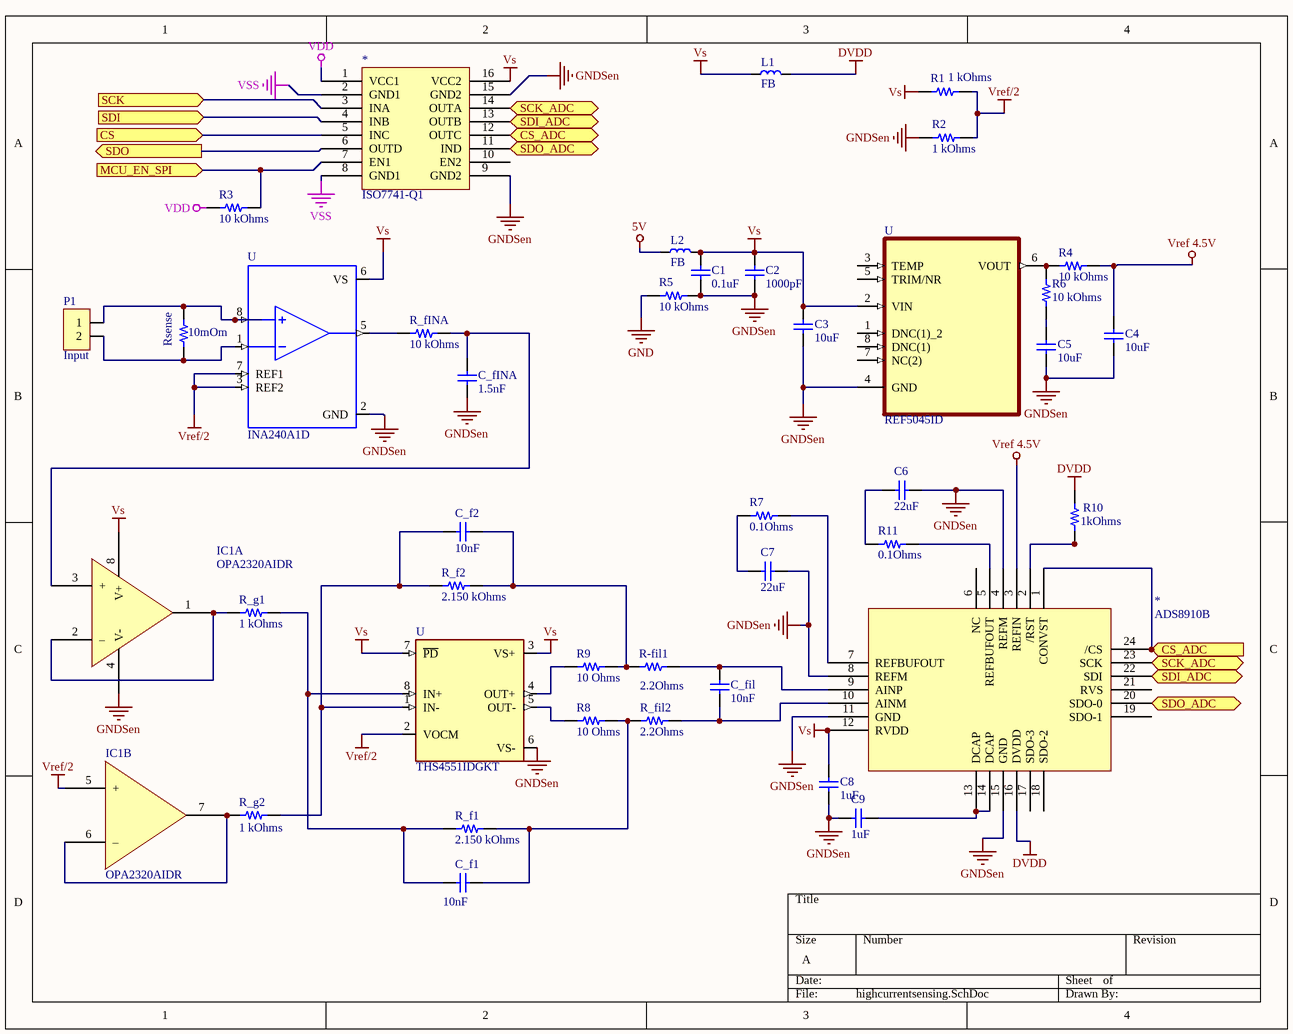
[diagram p5: highcurrentsensing.SchDoc]

### Parts
(Parts that share a designator on the sheet are numbered #1, #2 ... from top to bottom, then left to right.)
10mOm  Part Number: Rsense  [STACKPOLE CSR2512]
*#1  ISO7741-Q1  [*SOIC127P1030X265-16N]
*#2  ADS8910B  [*QFN50P400X400X100-25N]
C1  0.1uF  [C 0603]
C2  1000pF  [C 0603]
C3  10uF  [C 0805]
C4  10uF  [C 0805]
C5  10uF  [C 0805]
C6  22uF  [C 0805]
C7  22uF  [C 0805]
C8  1uF  [C 0805]
C9  1uF  [C 0805]
C_f1  10nF  [C 0805]
C_f2  10nF  [C 0805]
C_fil  10nF  [C 0805]
C_fINA  1.5nF  [C 0805]
IC1  OPA2320AIDR  [TI SOIC-8 D]  (parts A,B of 2)
L1  FB  [L 0805 (2012)]
L2  FB  [L 0805 (2012)]
P1  Input  [HDR/Terminal/2/10mm]
R1  1 kOhms  [RES 0603_1608]
R2  1 kOhms  [RES 0603_1608]
R3  10 kOhms  [RES 0603_1608]
R4  10 kOhms  [RES 0603_1608]
R5  10 kOhms  [RES 0603_1608]
R6  10 kOhms  [RES 0603_1608]
R7  0.1Ohms  [RES 0603_1608]
R8  10 Ohms  [RES 0603_1608]
R9  10 Ohms  [RES 0603_1608]
R10  1kOhms  [RES 0603_1608]
R11  0.1Ohms  [RES 0603_1608]
R-fil1  2.2Ohms  [RES 0603_1608]
R_f1  2.150 kOhms  [RES 0603_1608]
R_f2  2.150 kOhms  [RES 0603_1608]
R_fil2  2.2Ohms  [RES 0603_1608]
R_fINA  10 kOhms  [RES 0603_1608]
R_g1  1 kOhms  [RES 0603_1608]
R_g2  1 kOhms  [RES 0603_1608]
U#1  REF5045ID  [SOIC127P600X175-8N]
U#2  INA240A1D  [SOIC127P600X175-8N]
U#3  THS4551IDGKT  [SOP65P490X110-8N]

### Ports
CS (in), CS_ADC (in), CS_ADC (out), MCU_EN_SPI (in), SCK (in), SCK_ADC (in), SCK_ADC (out), SDI (in), SDI_ADC (in), SDI_ADC (out), SDO (out), SDO_ADC (in), SDO_ADC (out)

### Nets
5V: L2.1
DVDD: *#2.16(DVDD) L1.2 R10.2
GND: R5.2
GNDSen: *#1.9(GND2) *#1.15(GND2) *#2.4(REFM) *#2.8(REFM) *#2.11(GND) *#2.15(GND) C1.2 C2.2 C3.2 C4.2 C5.2 C6.2 C7.2 C8.2 C9.2 C_fINA.2 IC1.4(V-) R2.2 R5.1 U#1.4(GND) U#2.2(GND) U#3.6(VS-)
VDD: *#1.1(VCC1) R3.1
Vref 4.5V: *#2.3(REFIN) C4.1 R4.1
Vref/2: IC1.5(+) R1.2 R2.1 U#2.3(REF2) U#2.7(REF1) U#3.2(VOCM)
Vs: *#1.16(VCC2) *#2.12(RVDD) C1.1 C2.1 C3.1 C8.1 IC1.8(V+) L1.1 L2.2 R1.1 U#1.2(VIN) U#2.6(VS) U#3.3(VS+) U#3.7(~{PD})
VSS: *#1.2(GND1) *#1.8(GND1)
Net10mOm_1: 10mOm.1 P1.2 U#2.1(IN-)
Net10mOm_2: 10mOm.2 P1.1 U#2.8(IN+)
Net*#1_3: *#1.3(INA) ; port SCK
Net*#1_4: *#1.4(INB) ; port SDI
Net*#1_5: *#1.5(INC) ; port CS
Net*#1_6: *#1.6(OUTD) ; port SDO
Net*#1_7: *#1.7(EN1) R3.2 ; port MCU_EN_SPI
Net*#1_11: *#1.11(IND) *#2.20(SDO-0) ; port SDO_ADC
Net*#1_12: *#1.12(OUTC) *#2.1(CONVST) *#2.24(/CS) ; port CS_ADC
Net*#1_13: *#1.13(OUTB) *#2.22(SDI) ; port SDI_ADC
Net*#1_14: *#1.14(OUTA) *#2.23(SCK) ; port SCK_ADC
Net*#2_2: *#2.2(/RST) R10.1
Net*#2_5: *#2.5(REFBUFOUT) R11.1
Net*#2_7: *#2.7(REFBUFOUT) R7.1
Net*#2_9: *#2.9(AINP) C_fil.2 R-fil1.2
Net*#2_10: *#2.10(AINM) C_fil.1 R_fil2.2
Net*#2_13: *#2.13(DCAP) *#2.14(DCAP) C9.1
NetC5_1: C5.1 R6.2
NetC6_1: C6.1 R11.2
NetC7_1: C7.1 R7.2
NetC_f1_1: C_f1.1 R_f1.1 R_g1.2 U#3.8(IN+)
NetC_f1_2: C_f1.2 R8.2 R_f1.2 R_fil2.1
NetC_f2_1: C_f2.1 R_f2.1 R_g2.2 U#3.1(IN-)
NetC_f2_2: C_f2.2 R9.2 R-fil1.1 R_f2.2
NetC_fINA_1: C_fINA.1 IC1.3(+) R_fINA.2
NetIC1_1: IC1.1(OUT_A) IC1.2(–) R_g1.1
NetIC1_6: IC1.6(–) IC1.7(OUT_B) R_g2.1
NetR4_2: R4.2 R6.1 U#1.6(VOUT)
NetR8_1: R8.1 U#3.5(OUT-)
NetR9_1: R9.1 U#3.4(OUT+)
NetR_fINA_1: R_fINA.1 U#2.5(OUT)

Not connected (* = marked no-connect by the designer): *#1 10(EN2); *#2 6(NC) 17(SDO-3) 18(SDO-2) 19(SDO-1) 21(RVS); U#1 1(DNC(1)_2) 3(TEMP) 5(TRIM/NR) 7(NC(2)) 8(DNC(1))

### Library data of the parts
10mOm = CRM2512-JW-201ELF: RES SMD 200 OHM 5% 2W 2512; Package / Case: 2512 (6432 Metric)
C1-C9 = Capacitor NP: CAP CER 0.1UF 50V X7R 0603; TYPE: SMD; PACKAGE: SMD0603; STOCK CODE: CC0603KRX7R9BB104; SUPPLIER: tme.vn; STOCK DESC: 100nF/50V ±10% X7R SMD-0603 Capacitor; UNIT PRICE: 400
C_f1 C_f2 C_fil C_fINA = Capacitor NP: CAP CER 0.1UF 50V X7R 0603; PACKAGE: SMD0603; STOCK CODE: CC0603KRX7R9BB104; SUPPLIER: tme.vn; TYPE: SMD; STOCK DESC: 100nF/50V ±10% X7R SMD-0603 Capacitor; UNIT PRICE: 400
IC1 = OPA2320AIDR: IC OPAMP GP 2 CIRCUIT 8SOIC; Part Number: OPA2320AIDR
L1 L2 = Inductor
P1 = Header 2: Header, 2-Pin; UNIT PRICE: 0
R1-R11 R-fil1 R_f1 R_f2 R_fil2 R_fINA R_g1 R_g2 = RNCS0603BKE10K0: RES 10K OHM 0.1% 1/16W 0603; Part Number: RNCS0603BKE10K0
  R1 R2 R_g1 R_g2: Value: 1 kOhms
  R3-R6 R_fINA: Value: 10 kOhms
  R7 R11: Value: 0.1Ohms
  R8 R9: Value: 10 Ohms
  R10: Value: 1kOhms
  R-fil1 R_fil2: Value: 2.2Ohms
  R_f1 R_f2: Value: 2.150 kOhms
U#1 = REF5045ID: Series Voltage Reference IC Â±0.05% 8-VSSOP; MF: Texas Instruments; SnapEDA_Link: https://www.snapeda.com/parts/REF5045ID/Texas%20Instruments/view-part/1131648/?ref=snap; Availability: Unavailable; DigiKey-Purchase-URL: https://snapeda.com/shop?store=DigiKey&id=1131648; MP: REF5045ID; Package: SOIC-8 Texas Instruments; Value: *; Price: None
U#2 = INA240A1D: Current Sense Amplifier 1 Circuit 8-SOIC; MF: Texas Instruments; Package: SOIC-8 Texas Instruments; MP: INA240A1D; Price: None; Availability: Unavailable; Value: *; SnapEDA_Link: https://www.snapeda.com/parts/INA240A1D/Texas%20Instruments/view-part/2778825/?ref=snap
U#3 = THS4551IDGKT: Differential Amplifier 1 Circuit Rail-to-Rail 8-VSSOP; MF: Texas Instruments; Value: *; SnapEDA_Link: https://www.snapeda.com/parts/THS4551IDGKT/Texas%20Instruments/view-part/649050/?ref=snap; Availability: Unavailable; Package: MSOP-8 Texas Instruments; DigiKey-Purchase-URL: https://snapeda.com/shop?store=DigiKey&id=649050; Price: None; MP: THS4551IDGKT

## Nets that join several sheets
1V8: eBox_MCU (R201.1), eBox_Power (1V8.1 C111.1 C112.1 L102.2)
3V3_EXT: eBox_MCU (10 pins), eBox_Power (5 pins), eBox_LCD (7 pins)
5V: eBox_MCU (D204.2 P201.2 P201.4), eBox_Power (15 pins), highcurrentsensing (L2.1)
12V: eBox_3G (M401.1 M401.2), eBox_Power (9 pins)
GND: eBox_MCU (17 pins), eBox_3G (M401.9 M401.10), eBox_Power (43 pins), eBox_LCD (9 pins), highcurrentsensing (R5.2)
GNDEARTH: eBox_Notes (H6.1), eBox_Power (C106.2 C107.2)
VCC: eBox_MCU (D203.2 L202.1), eBox_Power (5 pins)
VDD: eBox_MCU (25 pins), highcurrentsensing (*#1.1 R3.1)
VSS: eBox_MCU (25 pins), highcurrentsensing (*#1.2 *#1.8)
I2C1_SCL: eBox_MCU (R210.2 R212.1 U203.4), eBox_LCD (U702.14)
I2C1_SDA: eBox_MCU (R211.2 R213.1 U203.6), eBox_LCD (U702.15)
NetR103_1: eBox_MCU (U201.8), eBox_Power (R103.1 R105.2)
PERST: eBox_MCU (U201.40), eBox_3G (M401.4)
PWRON: eBox_MCU (U201.39), eBox_3G (M401.3)
UART_RXD: eBox_MCU (U201.43), eBox_3G (M401.6)
UART_TXD: eBox_MCU (U201.42), eBox_3G (M401.8)